# Altium schematic sheet Sheet1.SchDoc
size A3
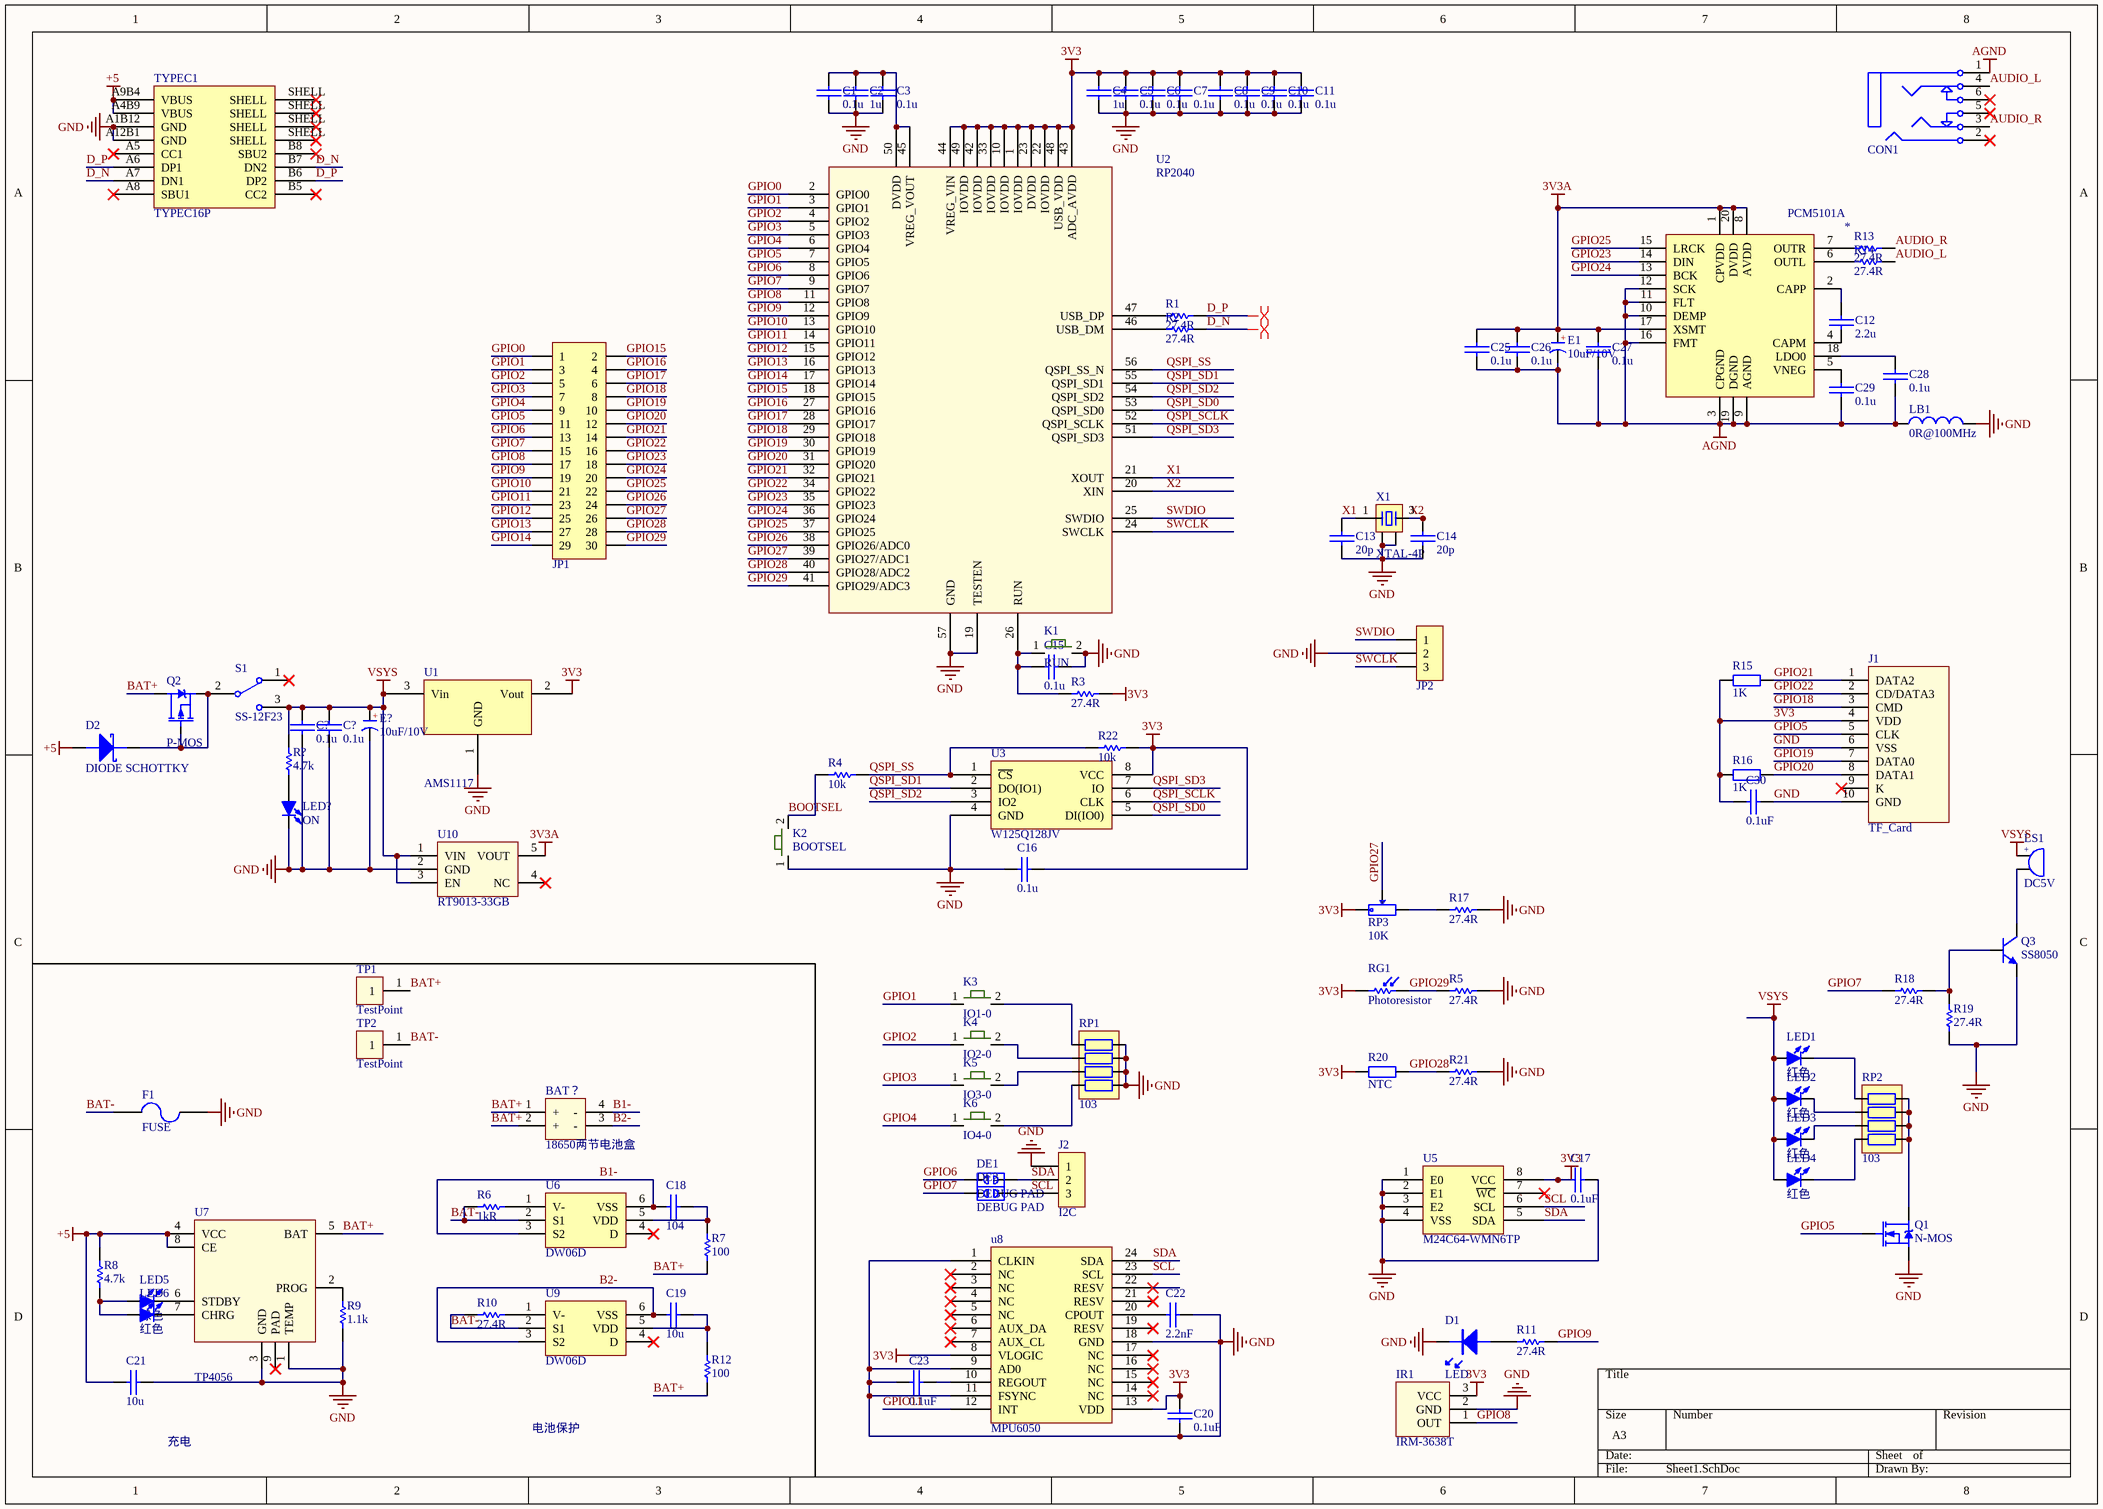
[diagram p0: Sheet1.SchDoc]

## Parts
(Parts that share a designator on the sheet are numbered #1, #2 ... from top to bottom, then left to right.)
*  PCM5101A  [TSSOP20]
BAT？  18650两节电池盒  [18650两节电池盒]
C1  0.1u  [0603C]
C2  1u  [0603C]
C3  0.1u  [0603C]
C4  1u  [0603C]
C5  0.1u  [0603C]
C6  0.1u  [0603C]
C7  0.1u  [0603C]
C8  0.1u  [0603C]
C9  0.1u  [0603C]
C10  0.1u  [0603C]
C11  0.1u  [0603C]
C12  2.2u  [0603C]
C13  20p  [0603C]
C14  20p  [0603C]
C15  0.1u  [0603C]
C16  0.1u  [0603C]
C17  0.1uF  [0603C]
C18  104  [0603C]
C19  10u  [0603C]
C20  0.1uF  [0603C]
C21  10u  [0603C]
C22  2.2nF  [0603C]
C23  0.1uF  [0603C]
C25  0.1u  [1206C]
C26  0.1u  [1206C]
C27  0.1u  [1206C]
C28  0.1u  [0603C]
C29  0.1u  [0603C]
C30  0.1uF  [0603C]
C?#1  0.1u  [1206C]
C?#2  0.1u  [1206C]
CON1  PJ342  [PJ342A]  (value not drawn)
D1  LED  [LED3-RED]
D2  DIODE SCHOTTKY  [SMA/DO-214AC]
DE1  DEBUG PAD  [DEBUG_B]
DE2  DEBUG PAD  [DEBUG_B]
E1  10uF/10V  [CM B(4*5.4)]
E?  10uF/10V  [CM B(4*5.4)]
F1  FUSE  [FUSE-1210]
IR1  IRM-3638T  [IRM-3638T]
J1  TF_Card  [Micro SD]
J2  I2C  [Pin HDR1X3/2.54mm-S]
JP1  Header 2X11  [HDR2.54-LI-2x15P]  (value not drawn)
JP2  HDR-1X3  [HDR2.54-LI-3P]  (value not drawn)
K1  RUN  [轻触按键]
K2  BOOTSEL  [轻触按键]
K3  IO1-0  [轻触按键]
K4  IO2-0  [轻触按键]
K5  IO3-0  [轻触按键]
K6  IO4-0  [轻触按键]
LB1  0R@100MHz  [FB 1206_L]
LED1  红色  [LED 1206W]
LED2  红色  [LED 1206W]
LED3  红色  [LED 1206W]
LED4  红色  [LED 1206W]
LED5  绿色  [LED 0603G]
LED6  红色  [LED 0603R]
LED?  ON  [LED 0603R]
LS1  DC5V  [BUZZER-7525]
Q1  N-MOS  [SOT23]
Q2  P-MOS  [SOT23]
Q3  SS8050  [SOT-23]
R1  27.4R  [0603R]
R2  27.4R  [0603R]
R3  27.4R  [0603R]
R4  10k  [0603R]
R5  27.4R  [0603R]
R6  1kR  [0603R]
R7  100  [0603R]
R8  4.7k  [0603R]
R9  1.1k  [0603R]
R10  27.4R  [0603R]
R11  27.4R  [0603R]
R12  100  [0603R]
R13  27.4R  [0603R]
R14  27.4R  [0603R]
R15  1K  [R 0603_L]
R16  1K  [R 0603_L]
R17  27.4R  [0603R]
R18  27.4R  [0603R]
R19  27.4R  [0603R]
R20  NTC  [R 0603_L]
R21  27.4R  [0603R]
R22  10k  [0603R]
R?  4.7k  [0603R]
RG1  Photoresistor  [Photoresistor]
RP1  103  [RCA-8P4R-0603]
RP2  103  [RCA-8P4R-0603]
RP3  10K  [拨盘电位器]
S1  SS-12F23  [MSK-12C01-07]
TP1  TestPoint  [TEST_POINT]
TP2  TestPoint  [TEST_POINT]
TYPEC1  TYPEC16P  [TYPEC-16P]
U1  AMS1117  [SOT89]
U2  RP2040  [QFN-56]
U3  W125Q128JV  [SOIC-8-208mil]
U5  M24C64-WMN6TP  [SOP8]
U6  DW06D  [SOT23-6]
U7  TP4056  [ESOP8]
u8  MPU6050  [QFN24 4x4]
U9  DW06D  [SOT23-6]
U10  RT9013-33GB  [SOT23-5]
X1  XTAL-4P  [OSC 3225-4P]

## Nets
3V3: C4.2 C5.2 C6.2 C7.2 C8.2 C9.2 C10.2 C11.2 C16.1 C17.2 C20.2 C30.1 IR1.3(VCC) J1.4(VDD) R3.2 R15.1 R16.1 R20.1 R22.2 RG1.1 RP3.1 U1.2(Vout) U2.1(IOVDD) U2.10(IOVDD) U2.22(IOVDD) U2.23(DVDD) U2.33(IOVDD) U2.42(IOVDD) U2.43(ADC_AVDD) U2.44(VREG_VIN) U2.48(USB_VDD) U2.49(IOVDD) U3.8(VCC) U5.8(VCC) u8.8(VLOGIC) u8.13(VDD)
3V3A: *.1(CPVDD) *.8(AVDD) *.17(XSMT) *.20(DVDD) C25.1 C26.1 C27.1 E1.1(A) U10.5(VOUT)
+5: C21.1 D2.A R8.2 TYPEC1.A4B9(VBUS) TYPEC1.A9B4(VBUS) U7.4(VCC) U7.8(CE)
AGND: *.3(CPGND) *.9(AGND) *.10(DEMP) *.11(FLT) *.12(SCK) *.16(FMT) *.19(DGND) C25.2 C26.2 C27.2 C28.2 C29.2 CON1.1 E1.2(K) LB1.1
GND: C1.1 C2.1 C3.1 C4.1 C5.1 C6.1 C7.1 C8.1 C9.1 C10.1 C11.1 C13.1 C14.1 C15.1 C16.2 C17.1 C20.1 C21.2 C22.1 C23.1 C30.2 C?#1.2 C?#2.2 D1.K E?.2(K) F1.2 IR1.2(GND) J1.6(VSS) J1.10(GND) J2.1 JP2.2 K1.2 K2.1 LB1.2 LED?.2(K) Q1.S Q3.2(E) R5.2 R9.1 R17.2 R19.1 R21.2 RP1.5 RP1.6 RP1.7 RP1.8 TYPEC1.A1B12(GND) TYPEC1.A12B1(GND) U1.1(GND) U2.19(TESTEN) U2.57(GND) U3.4(GND) U5.1(E0) U5.2(E1) U5.3(E2) U5.4(VSS) U7.1(TEMP) U7.3(GND) u8.1(CLKIN) u8.9(AD0) u8.11(FSYNC) u8.18(GND) U10.2(GND) X1.2 X1.4
VSYS: C?#1.1 C?#2.1 E?.1(A) LED1.1(A) LED2.1(A) LED3.1(A) LED4.1(A) LS1.1 R?.2 S1.3 U1.3(Vin) U10.1(VIN) U10.3(EN)
AUDIO_L: CON1.4 R14.2
AUDIO_R: CON1.3 R13.2
B1-: BAT？.4(-) C18.1 U6.3(S2) U6.6(VSS)
B2-: BAT？.3(-) C19.1 U9.3(S2) U9.6(VSS)
BAT+: BAT？.1(+) BAT？.2(+) Q2.D R7.2 R12.2 TP1.1 U7.5(BAT)
BAT-: F1.1 R6.2 R10.2 TP2.1 U6.2(S1) U9.2(S1)
BOOTSEL: K2.2 R4.1
D_N: R2.2 TYPEC1.A7(DN1) TYPEC1.B7(DN2)
D_P: R1.2 TYPEC1.A6(DP1) TYPEC1.B6(DP2)
GPIO0: JP1.1 U2.2(GPIO0)
GPIO1: JP1.3 K3.1 U2.3(GPIO1)
GPIO2: JP1.5 K4.1 U2.4(GPIO2)
GPIO3: JP1.7 K5.1 U2.5(GPIO3)
GPIO4: JP1.9 K6.1 U2.6(GPIO4)
GPIO5: J1.5(CLK) JP1.11 Q1.G U2.7(GPIO5)
GPIO6: DE1.1 JP1.13 U2.8(GPIO6)
GPIO7: DE2.1 JP1.15 R18.1 U2.9(GPIO7)
GPIO8: IR1.1(OUT) JP1.17 U2.11(GPIO8)
GPIO9: JP1.19 R11.2 U2.12(GPIO9)
GPIO10: JP1.21 U2.13(GPIO10)
GPIO11: JP1.23 U2.14(GPIO11) u8.12(INT)
GPIO12: JP1.25 U2.15(GPIO12)
GPIO13: JP1.27 U2.16(GPIO13)
GPIO14: JP1.29 U2.17(GPIO14)
GPIO15: JP1.2 U2.18(GPIO15)
GPIO16: JP1.4 U2.27(GPIO16)
GPIO17: JP1.6 U2.28(GPIO17)
GPIO18: J1.3(CMD) JP1.8 U2.29(GPIO18)
GPIO19: J1.7(DATA0) JP1.10 U2.30(GPIO19)
GPIO20: J1.8(DATA1) JP1.12 R16.2 U2.31(GPIO20)
GPIO21: J1.1(DATA2) JP1.14 R15.2 U2.32(GPIO21)
GPIO22: J1.2(CD/DATA3) JP1.16 U2.34(GPIO22)
GPIO23: *.14(DIN) JP1.18 U2.35(GPIO23)
GPIO24: *.13(BCK) JP1.20 U2.36(GPIO24)
GPIO25: *.15(LRCK) JP1.22 U2.37(GPIO25)
GPIO26: JP1.24 U2.38(GPIO26/ADC0)
GPIO27: JP1.26 RP3.2 U2.39(GPIO27/ADC1)
GPIO28: JP1.28 R20.2 R21.1 U2.40(GPIO28/ADC2)
GPIO29: JP1.30 R5.1 RG1.2 U2.41(GPIO29/ADC3)
QSPI_SCLK: U2.52(QSPI_SCLK) U3.6(CLK)
QSPI_SD0: U2.53(QSPI_SD0) U3.5(DI(IO0))
QSPI_SD1: U2.55(QSPI_SD1) U3.2(DO(IO1))
QSPI_SD2: U2.54(QSPI_SD2) U3.3(IO2)
QSPI_SD3: U2.51(QSPI_SD3) U3.7(IO)
QSPI_SS: R4.2 R22.1 U2.56(QSPI_SS_N) U3.1(~{CS})
SCL: DE2.2 J2.3 U5.6(SCL) u8.23(SCL)
SDA: DE1.2 J2.2 U5.5(SDA) u8.24(SDA)
SWCLK: JP2.3 U2.24(SWCLK)
SWDIO: JP2.1 U2.25(SWDIO)
X1: C13.2 U2.21(XOUT) X1.1
X2: C14.2 U2.20(XIN) X1.3
Net*_2: *.2(CAPP) C12.1
Net*_4: *.4(CAPM) C12.2
Net*_5: *.5(VNEG) C29.1
Net*_6: *.6(OUTL) R14.1
Net*_7: *.7(OUTR) R13.1
Net*_18: *.18(LDO0) C28.1
NetC1_2: C1.2 C2.2 C3.2 U2.45(VREG_VOUT) U2.50(DVDD)
NetC15_2: C15.2 K1.1 R3.1 U2.26(RUN)
NetC18_2: C18.2 R7.1 U6.5(VDD)
NetC19_2: C19.2 R12.1 U9.5(VDD)
NetC22_2: C22.2 u8.20(CPOUT)
NetC23_2: C23.2 u8.10(REGOUT)
NetD1_A: D1.A R11.1
NetD2_K: D2.K Q2.G Q2.S S1.2
NetK3_2: K3.2 RP1.1
NetK4_2: K4.2 RP1.2
NetK5_2: K5.2 RP1.3
NetK6_2: K6.2 RP1.4
NetLED1_2: LED1.2(K) RP2.1
NetLED2_2: LED2.2(K) RP2.2
NetLED3_2: LED3.2(K) RP2.3
NetLED4_2: LED4.2(K) RP2.4
NetLED5_1: LED5.1(A) LED6.1(A) R8.1
NetLED5_2: LED5.2(K) U7.6(STDBY)
NetLED6_2: LED6.2(K) U7.7(CHRG)
NetLED?_1: LED?.1(A) R?.1
NetLS1_2: LS1.2 Q3.3(C)
NetQ1_D: Q1.D RP2.5 RP2.6 RP2.7 RP2.8
NetQ3_1: Q3.1(B) R18.2 R19.2
NetR1_1: R1.1 U2.47(USB_DP)
NetR2_1: R2.1 U2.46(USB_DM)
NetR6_1: R6.1 U6.1(V-)
NetR9_2: R9.2 U7.2(PROG)
NetR10_1: R10.1 U9.1(V-)
NetR17_1: R17.1 RP3.3

Not connected (* = marked no-connect by the designer): CON1 2* 5* 6*; J1 9(K)*; S1 1*; TYPEC1 A5(CC1)* A8(SBU1)* B5(CC2)* B8(SBU2)* SHELL*; U5 7(~{WC})*; U6 4(D)*; U7 9(PAD)*; u8 2(NC)* 3(NC)* 4(NC)* 5(NC)* 6(AUX_DA)* 7(AUX_CL)* 14(NC)* 15(NC)* 16(NC)* 17(NC)* 19(RESV)* 21(RESV)* 22(RESV)*; U9 4(D)*; U10 4(NC)*

## Layout directives
differential pair: D_N, D_P

## Notes on the sheet
- 充电
- 电池保护
- (in symbol BEEP) +
- (in symbol C-CM) +

## Library data of the parts
C1 C3 C5-C23 C25-C30 C?#1 C?#2 = CAP: 无极性电容
C2 C4 = CAP: 靠近RP2040
CON1 = PJ342: 3.5耳机插座,4Pin; BOM名称: 耳机插座; 版权归属: 源创客; 学习资源: www.ooocke.com
D2 = DIODE SCHOTTKY: 肖特基二极管
DE1 DE2 = DEBUG: 调试断点焊盘; 版权归属: 源创客; BOM名称: 调试断点焊盘; 学习资源: www.ooocke.com
E1 E? = C-CM: 贴片电解电容; 版权归属: 源创客; BOM名称: 贴片电解电容; 学习资源: www.ooocke.com
J1 = TF_Card: TF卡座; 版权归属: 源创客; BOM名称: TF卡座; 学习资源: www.ooocke.com
J2 = Pin HDR1X3
JP1 = Header 15X2: 15*2P接插件; 版权归属: 源创客; BOM名称: 15*2P接插件; 学习资源: www.ooocke.com
JP2 = Header 3: 3P接插件; 版权归属: 源创客; BOM名称: 3P接插件; 学习资源: www.ooocke.com
K1-K6 = 两脚轻触开关
LB1 = LB: 磁珠; 版权归属: 源创客; BOM名称: 磁珠; 学习资源: www.ooocke.com
LED1-LED6 LED? = LED-SMD: 贴片LED; 版权归属: 源创客; BOM名称: 贴片LED; 学习资源: www.ooocke.com
LS1 = BEEP: 蜂鸣器; 版权归属: 源创客; BOM名称: 蜂鸣器; 学习资源: www.ooocke.com
Q1 = N-MOS: N沟道场效应管
Q2 = P-MOS: P沟道场效应管
Q3 = 8050-SMD: 高频放大-NPN型; 版权归属: 源创客; 属性: 40V 1.5A 1W 100MHZ; BOM名称: 高频放大-NPN型; 学习资源: www.ooocke.com
R1-R14 R17-R19 R21 R22 R? = RES
R15 R16 R20 = R: 贴片电阻; 版权归属: 源创客; BOM名称: 贴片电阻; 学习资源: www.ooocke.com
RG1 = Photoresistor: 光敏电阻
RP1 RP2 = R-8P4R: 贴片网络排阻; 版权归属: 源创客; BOM名称: 贴片网络排阻; 学习资源: www.ooocke.com
RP3 = RP-SMD: 贴片电位器; 版权归属: 源创客; BOM名称: 贴片电位器; 学习资源: www.ooocke.com
S1 = SSW-1P: 1路波动开关; BOM名称: 波动开关; 版权归属: 源创客; 学习资源: www.ooocke.com
U1 = AMS1117: 三端稳压芯片
X1 = XTAL-4P: 4脚无源晶振